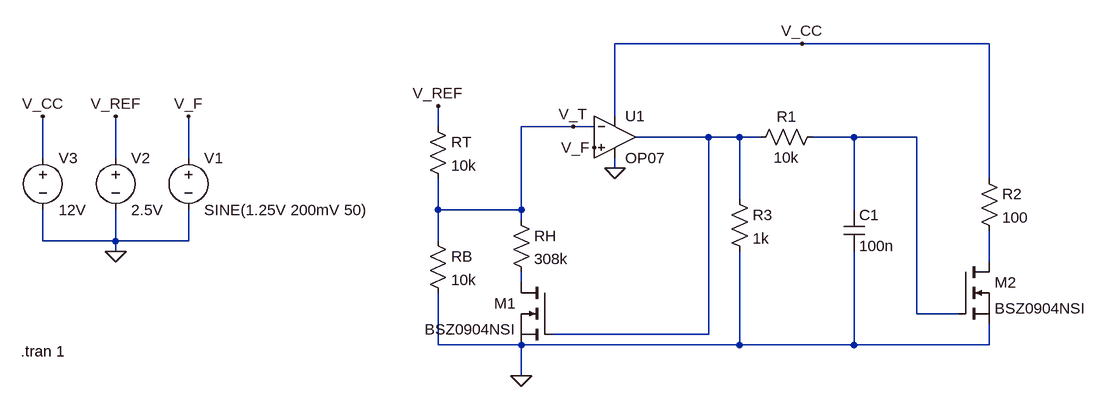
[diagram p0: schematic Draft1.asc]
Draft1.asc, the LTspice schematic file:
Version 4
SHEET 1 1548 680
WIRE 976 -80 688 -80
WIRE 1264 -80 976 -80
WIRE 688 32 688 -80
WIRE 416 48 416 16
WIRE 624 48 544 48
WIRE 656 48 624 48
WIRE 832 64 720 64
WIRE 880 64 832 64
WIRE 912 64 880 64
WIRE 1056 64 992 64
WIRE 1152 64 1056 64
WIRE -192 96 -192 32
WIRE -80 96 -80 32
WIRE 32 96 32 32
WIRE 688 112 688 96
WIRE 1264 128 1264 -80
WIRE 880 160 880 64
WIRE 416 176 416 128
WIRE 544 176 544 48
WIRE 544 176 416 176
WIRE 1056 176 1056 64
WIRE 544 192 544 176
WIRE -192 224 -192 176
WIRE -80 224 -80 176
WIRE -80 224 -192 224
WIRE 32 224 32 176
WIRE 32 224 -80 224
WIRE 416 224 416 176
WIRE -80 240 -80 224
WIRE 1264 256 1264 208
WIRE 544 288 544 272
WIRE 1152 336 1152 64
WIRE 1216 336 1152 336
WIRE 832 368 832 64
WIRE 832 368 592 368
WIRE 416 384 416 304
WIRE 544 384 544 368
WIRE 544 384 416 384
WIRE 880 384 880 240
WIRE 880 384 544 384
WIRE 1056 384 1056 240
WIRE 1056 384 880 384
WIRE 1264 384 1264 352
WIRE 1264 384 1056 384
WIRE 544 432 544 384
FLAG 688 112 0
FLAG 416 16 V_REF
FLAG 656 80 V_F
FLAG 32 32 V_F
FLAG -80 240 0
FLAG -80 32 V_REF
FLAG -192 32 V_CC
FLAG 544 432 0
FLAG 624 48 V_T
FLAG 976 -80 V_CC
SYMBOL voltage 32 80 R0
WINDOW 123 0 0 Left 0
WINDOW 39 0 0 Left 0
SYMATTR InstName V1
SYMATTR Value SINE(1.25V 200mV 50)
SYMBOL res 400 32 R0
SYMATTR InstName RT
SYMATTR Value 10k
SYMBOL res 400 208 R0
SYMATTR InstName RB
SYMATTR Value 10k
SYMBOL res 528 176 R0
SYMATTR InstName RH
SYMATTR Value 308k
SYMBOL OpAmps\\OP07 688 0 R0
SYMATTR InstName U1
SYMBOL nmos 592 288 M0
SYMATTR InstName M1
SYMATTR Value BSZ0904NSI
SYMBOL voltage -80 80 R0
WINDOW 123 0 0 Left 0
WINDOW 39 0 0 Left 0
SYMATTR InstName V2
SYMATTR Value 2.5V
SYMBOL voltage -192 80 R0
WINDOW 123 0 0 Left 0
WINDOW 39 0 0 Left 0
SYMATTR InstName V3
SYMATTR Value 12V
SYMBOL cap 1040 176 R0
SYMATTR InstName C1
SYMATTR Value 100n
SYMBOL res 1008 48 R90
WINDOW 0 0 56 VBottom 2
WINDOW 3 32 56 VTop 2
SYMATTR InstName R1
SYMATTR Value 10k
SYMBOL nmos 1216 256 R0
SYMATTR InstName M2
SYMATTR Value BSZ0904NSI
SYMBOL res 1248 112 R0
SYMATTR InstName R2
SYMATTR Value 100
SYMBOL res 864 144 R0
SYMATTR InstName R3
SYMATTR Value 1k
TEXT -226 394 Left 2 !.tran 1

The netlist it stands for:
* Draft1.asc
V1 V_F 0 SINE(1.25V 200mV 50)
RT V_REF V_T 10k
RB V_T 0 10k
RH V_T N004 308k
XU1 V_F V_T V_CC 0 N001 LT1001  ; OP07, pins In+ In- V+ V- OUT
M1 N004 N001 0 0 BSZ0904NSI
V2 V_REF 0 2.5V
V3 V_CC 0 12V
C1 N002 0 100n
R1 N002 N001 10k
M2 N003 N002 0 0 BSZ0904NSI
R2 V_CC N003 100
R3 N001 0 1k
.model NMOS NMOS
.model PMOS PMOS
.lib standard.mos
.tran 1
.lib LTC.lib
.backanno
.end